# EAGLE design motherboard (EAGLE 5.06)
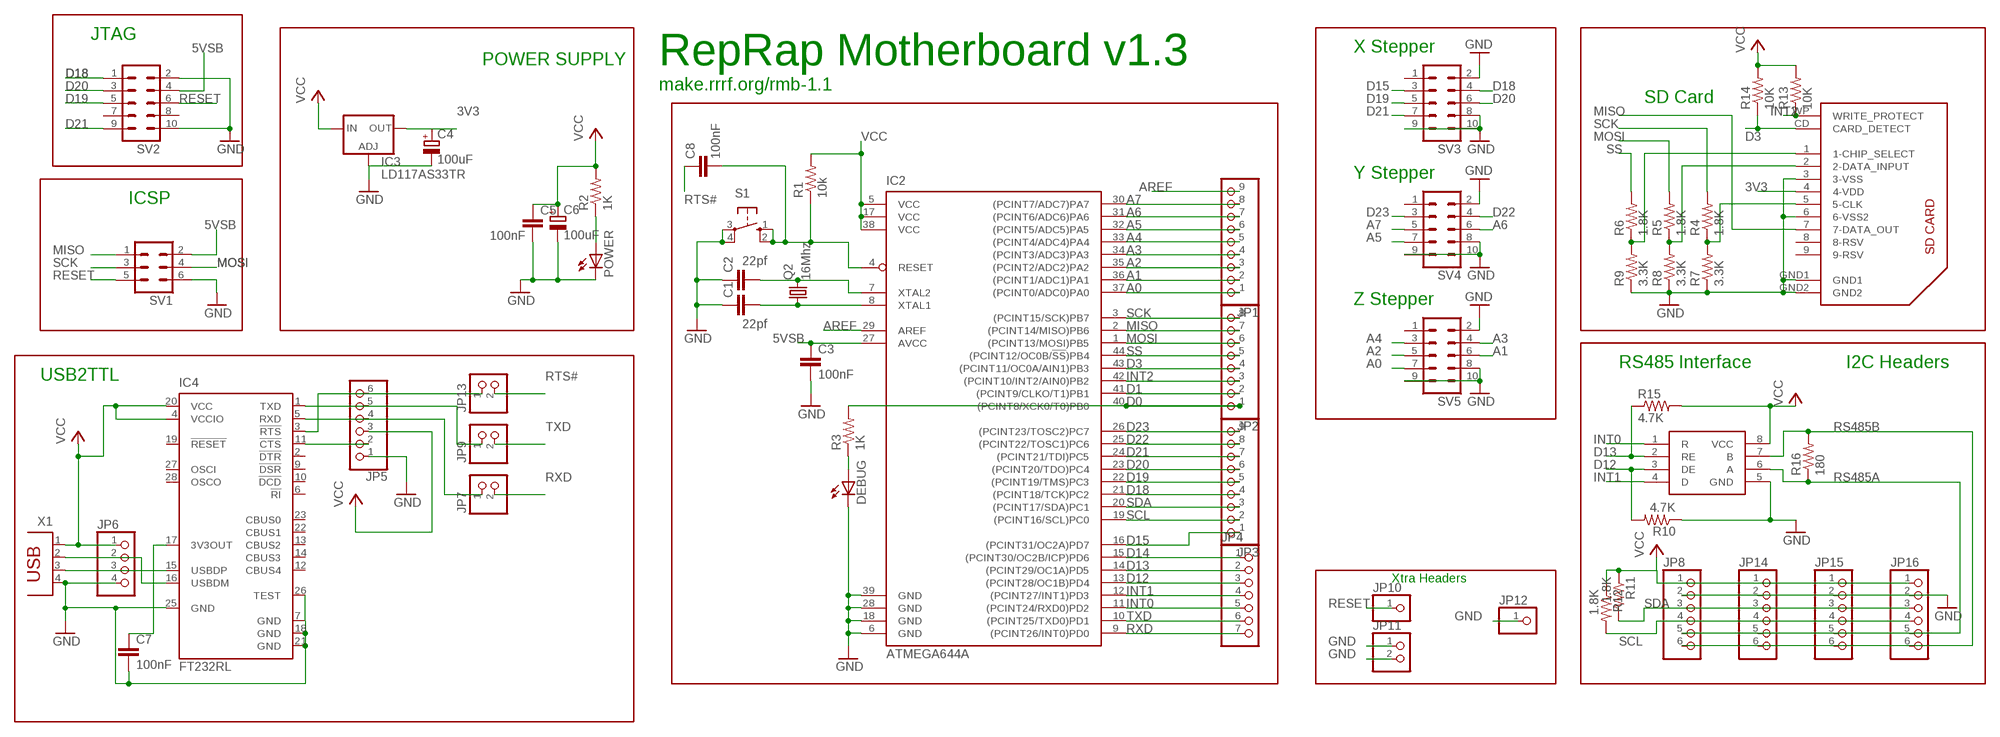
[diagram p0: schematic, sheet 1]

## Parts
C1  22pf  C-EUC1206  [C1206]
C2  22pf  C-EUC1206  [C1206]
C3  100nF  C-EUC1206  [C1206]
C4  100uF  CPOL-EUSANYO_SMD_B6  [SANYO-OSCON_SMD_B6]
C5  100nF  C-EUC1206  [C1206]
C6  100uF  CPOL-EUSANYO_SMD_B6  [SANYO-OSCON_SMD_B6]
C7  100nF  C-EUC1206  [C1206]
C8  100nF  C-EUC1206  [C1206]
DEBUG  LEDCHIPLED_1206  [CHIPLED_1206]
IC1  SN75176ASOIC  [SO08]
IC2  ATMEGA644A  [TQFP44]
IC3  LD117AS33TR  [SOT223]
IC4  FT232RL  [SSOP28]
JP1  PINHD-1X9  [1X09]
JP2  PINHD-1X8  [1X08]
JP3  PINHD-1X9  [1X09]
JP4  PINHD-1X7  [1X07]
JP5  PINHD-1X6  [1X06]
JP6  PINHD-1X4  [1X04]
JP7  PINHD-1X2  [1X02]
JP8  PINHD-1X6  [1X06]
JP9  PINHD-1X2  [1X02]
JP10  PINHD-1X1  [1X01]
JP11  PINHD-1X2  [1X02]
JP12  PINHD-1X1  [1X01]
JP13  PINHD-1X2  [1X02]
JP14  PINHD-1X6  [1X06]
JP15  PINHD-1X6  [1X06]
JP16  PINHD-1X6  [1X06]
POWER  LEDCHIPLED_1206  [CHIPLED_1206]
Q2  16Mhz  CRYSTALHC49UV  [HC49U-V]
R1  10k  R-US_R1206  [R1206]
R2  1K  R-US_R1206  [R1206]
R3  1K  R-US_R1206  [R1206]
R4  1.8K  R-US_R1206  [R1206]
R5  1.8K  R-US_R1206  [R1206]
R6  1.8K  R-US_R1206  [R1206]
R7  3.3K  R-US_R1206  [R1206]
R8  3.3K  R-US_R1206  [R1206]
R9  3.3K  R-US_R1206  [R1206]
R10  4.7K  R-US_R1206  [R1206]
R11  1.8K  R-US_R1206  [R1206]
R12  1.8K  R-US_R1206  [R1206]
R13  10K  R-US_R1206  [R1206]
R14  10K  R-US_R1206  [R1206]
R15  4.7K  R-US_R1206  [R1206]
R16  180  R-US_R1206  [R1206]
S1  10-XX  [B3F-10XX]
SV1  ML6  [ML6]
SV2  ML10  [ML10]
SV3  ML10  [ML10]
SV4  ML10  [ML10]
SV5  ML10  [ML10]
U$8  SDCARD  [3M-SDCARD]
X1  PN61729  [PN61729]

## Nets
3V3: C4.+ IC3.4(OUT) U$8.4(4-VDD)
5VSB: C3.1 IC2.27(AVCC) SV1.2 SV2.4
A0: IC2.37((PCINT0/ADC0)PA0) JP1.1 SV5.7
A1: IC2.36((PCINT1/ADC1)PA1) JP1.2 SV5.6
A2: IC2.35((PCINT2/ADC2)PA2) JP1.3 SV5.5
A3: IC2.34((PCINT3/ADC3)PA3) JP1.4 SV5.4
A4: IC2.33((PCINT4/ADC4)PA4) JP1.5 SV5.3
A5: IC2.32((PCINT5/ADC5)PA5) JP1.6 SV4.7
A6: IC2.31((PCINT6/ADC6)PA6) JP1.7 SV4.6
A7: IC2.30((PCINT7/ADC7)PA7) JP1.8 SV4.5
AREF: IC2.29(AREF) JP1.9
D0: IC2.40((PCINT8/XCK0/T0)PB0) JP2.1 R3.2
D1: IC2.41((PCINT9/CLKO/T1)PB1) JP2.2
D3: IC2.43((PCINT11/OC0A/AIN1)PB3) JP2.4 R14.1 U$8.CD(CARD_DETECT)
D12: IC1.3(DE) IC2.13((PCINT28/OC1B)PD4) JP4.3 R10.2
D13: IC1.2(RE) IC2.14((PCINT29/OC1A)PD5) JP4.2 R15.1
D14: IC2.15((PCINT30/OC2B/ICP)PD6) JP4.1
D15: IC2.16((PCINT31/OC2A)PD7) JP3.1 SV3.3
D18: IC2.21((PCINT18/TCK)PC2) JP3.4 SV2.1 SV3.4
D19: IC2.22((PCINT19/TMS)PC3) JP3.5 SV2.5 SV3.5
D20: IC2.23((PCINT20/TDO)PC4) JP3.6 SV2.3 SV3.6
D21: IC2.24((PCINT21/TDI)PC5) JP3.7 SV2.9 SV3.7
D22: IC2.25((PCINT22/TOSC1)PC6) JP3.8 SV4.4
D23: IC2.26((PCINT23/TOSC2)PC7) JP3.9 SV4.3
GND [power]: C1.1 C2.1 C3.2 C4.- C5.2 C6.- C7.2 DEBUG.C IC1.5(GND) IC2.6(GND) IC2.18(GND) IC2.28(GND) IC2.39(GND) IC3.1(ADJ) IC4.7(GND) IC4.18(GND) IC4.21(GND) IC4.25(GND) IC4.26(TEST) JP5.1 JP6.4 JP8.2 JP11.1 JP11.2 JP12.1 JP14.2 JP15.2 JP16.2 POWER.C R7.1 R8.1 R9.1 R10.1 S1.3(P) S1.4(P1) SV1.6 SV2.2 SV2.10 SV3.2 SV3.8 SV3.9 SV3.10 SV4.2 SV4.8 SV4.9 SV4.10 SV5.2 SV5.8 SV5.9 SV5.10 U$8.3(3-VSS) U$8.6(6-VSS2) U$8.GND1 U$8.GND2 X1.4
INT0: IC1.1(R) IC2.11((PCINT24/RXD0)PD2) JP4.5
INT1: IC1.4(D) IC2.12((PCINT27/INT1)PD3) JP4.4
INT2: IC2.42((PCINT10/INT2/AIN0)PB2) JP2.3 R13.1 U$8.WP(WRITE_PROTECT)
MISO: IC2.2((PCINT14/MISO)PB6) JP2.7 SV1.1 U$8.7(7-DATA_OUT)
MOSI: IC2.1((PCINT13/MOSI)PB5) JP2.6 R5.2 SV1.4
N$1: C2.2 IC2.7(XTAL2) Q2.2
N$2: IC4.11(!CTS) JP5.2
N$3: IC4.15(USBDP) JP6.3 X1.3
N$4: POWER.A R2.1
N$5: IC4.16(USBDM) JP6.2 X1.2
N$6: C7.1 IC4.17(3V3OUT)
N$7: DEBUG.A R3.1
N$8: C1.2 IC2.8(XTAL1) Q2.1
N$14: R6.1 R9.2 U$8.1(1-CHIP_SELECT)
N$17: R5.1 R8.2 U$8.2(2-DATA_INPUT)
N$23: R4.1 R7.2 U$8.5(5-CLK)
RESET: C8.2 IC2.4(RESET) JP10.1 R1.1 S1.1(S) S1.2(S1) SV1.5 SV2.6
RS485A: IC1.6(A) JP8.5 JP14.5 JP15.5 JP16.5 R16.1
RS485B: IC1.7(B) JP8.6 JP14.6 JP15.6 JP16.6 R16.2
RTS#: C8.1 JP13.2
RTS##: IC4.3(!RTS) JP5.6 JP13.1
RXD: IC2.9((PCINT26/INT0)PD0) JP4.7 JP7.2
RXD#: IC4.5(RXD) JP5.4 JP7.1
SCK: IC2.3((PCINT15/SCK)PB7) JP2.8 R4.2 SV1.3
SCL: IC2.19((PCINT16/SCL)PC0) JP3.2 JP8.4 JP14.4 JP15.4 JP16.4 R12.2
SDA: IC2.20((PCINT17/SDA)PC1) JP3.3 JP8.3 JP14.3 JP15.3 JP16.3 R11.2
SS: IC2.44((PCINT12/OC0B/!SS!)PB4) JP2.5 R6.2
TXD: IC2.10((PCINT25/TXD0)PD1) JP4.6 JP9.2
TXD#: IC4.1(TXD) JP5.5 JP9.1
VCC [power]: C5.1 C6.+ IC1.8(VCC) IC2.5(VCC) IC2.17(VCC) IC2.38(VCC) IC3.3(IN) IC4.4(VCCIO) IC4.20(VCC) JP5.3 JP6.1 JP8.1 JP14.1 JP15.1 JP16.1 R1.2 R2.2 R11.1 R12.1 R13.2 R14.2 R15.2 X1.1
Unconnected: IC4.2(!DTR) IC4.6(!RI) IC4.9(!DSR) IC4.10(!DCD) IC4.12(CBUS4) IC4.13(CBUS2) IC4.14(CBUS3) IC4.19(!RESET) IC4.22(CBUS1) IC4.23(CBUS0) IC4.27(OSCI) IC4.28(OSCO) SV2.7 SV2.8 SV3.1 SV4.1 SV5.1 U$8.8(8-RSV) U$8.9(9-RSV)

## Notes on the sheet
- JTAG
- X Stepper
- POWER SUPPLY | RepRap Motherboard v1.3
- make.rrrf.org/rmb-1.1
- SD Card
- Y Stepper
- ICSP
- Z Stepper
- RS485 Interface | I2C Headers
- USB2TTL
- Xtra Headers

## Library data of the parts
C1-C3 C5 C7 C8 = rcl:C-EU: CAPACITOR, European symbol
C4 C6 = rcl:CPOL-EU: POLARIZED CAPACITOR, European symbol
DEBUG POWER = led:LED: LED OSRAM: - CHIPLED LG R971, LG N971, LY N971, LG Q971, LY Q971, LO R971, LY R971 LH N974, LH R974 LS Q976, LO Q976, LY Q976 LO Q996 - Hyper CHIPLED LW Q18S LB Q993, LB Q99A, LB R99A - SideLED LS A670, LO A670, LY A670, LG A670, LP A670 LB A673, LV A673, LT A673, LW A673 LH A674 LY A675 LS A676, LA A676, LO A676, LY A676, LW A676 LS A679, LY A679, LG A679 - Hyper Micro SIDELED® LS Y876, LA Y876, LO Y876, LY Y876 LT Y87S - SmartLED LW L88C, LW L88S LB L89C, LB L89S, LG L890 LS L89K, LO L89K, LY L89K LS L896, LA L896, LO L896, LY L896 - TOPLED LS T670, LO T670, LY T670, LG T670, LP T670 LSG T670, LSP T670, LSY T670, LOP T670, LYG T670 LG T671, LOG T671, LSG T671 LB T673, LV T673, LT T673, LW T673 LH T674 LS T676, LA T676, LO T676, LY T676, LB T676, LH T676, LSB T676, LW T676 LB T67C, LV T67C, LT T67C, LS T67K, LO T67K, LY T67K, LW E67C LS E67B, LA E67B, LO E67B, LY E67B, LB E67C, LV E67C, LT E67C LW T67C LS T679, LY T679, LG T679 LS T770, LO T770, LY T770, LG T770, LP T770 LB T773, LV T773, LT T773, LW T773 LH T774 LS E675, LA E675, LY E675, LS T675 LS T776, LA T776, LO T776, LY T776, LB T776 LHGB T686 LT T68C, LB T68C - Hyper Mini TOPLED® LB M676 - Mini TOPLED Santana® LG M470 LS M47K, LO M47K, LY M47K Source: http://www.osram.convergy.de - LUMILED® LXK2-PW12-R00, LXK2-PW12-S00, LXK2-PW14-U00, LXK2-PW14-V00 LXK2-PM12-R00, LXK2-PM12-S00, LXK2-PM14-U00 LXK2-PE12-Q00, LXK2-PE12-R00, LXK2-PE12-S00, LXK2-PE14-T00, LXK2-PE14-U00 LXK2-PB12-K00, LXK2-PB12-L00, LXK2-PB12-M00, LXK2-PB14-N00, LXK2-PB14-P00, LXK2-PB14-Q00 LXK2-PR12-L00, LXK2-PR12-M00, LXK2-PR14-Q00, LXK2-PR14-R00 LXK2-PD12-Q00, LXK2-PD12-R00, LXK2-PD12-S00 LXK2-PH12-R00, LXK2-PH12-S00 LXK2-PL12-P00, LXK2-PL12-Q00, LXK2-PL12-R00 Source: www.luxeon.com
IC1 = reprap:SN75176A
IC2 = atmel:ATMEGA644: 8-bit Microcontroller with 64K Bytes In-System Programmable Flash Source: http://www.atmel.com/dyn/resources/prod_documents/doc2593.pdf
IC3 = v-reg:LD117A?*: Low drop fixed and adjustable positive voltage regulators 1 A Source: http://www.st.com/stonline/products/literature/ds/7194/ld1117axx.pdf
IC4 = ftdichip:FT232R: Source: http://www.ftdichip.com/Documents/DataSheets/DS_FT232R_v104.pdf
JP1 JP3 = pinhead:PINHD-1X9: PIN HEADER
JP2 = pinhead:PINHD-1X8: PIN HEADER
JP4 = pinhead:PINHD-1X7: PIN HEADER
JP5 JP8 JP14-JP16 = pinhead:PINHD-1X6: PIN HEADER
JP6 = pinhead:PINHD-1X4: PIN HEADER
JP7 JP9 JP11 JP13 = pinhead:PINHD-1X2: PIN HEADER
JP10 JP12 = pinhead:PINHD-1X1: PIN HEADER
Q2 = SparkFun:CRYSTAL: Crystals Various standard crystals. Proven footprints. Spark Fun Electronics SKU : COM-00534
R1 R2 R10-R16 = rcl:R-US_: RESISTOR, American symbol
R3-R9 = resistor:R-US_: RESISTOR, American symbol
S1 = switch-omron:10-XX: OMRON SWITCH
SV1 = con-harting-ml:ML6: HARTING
SV2 SV3 = con-harting-ml:ML10: HARTING
SV4 SV5 = con-ml:ML10: HARTING
U$8 = reprap:SDCARD
X1 = con-berg:PN61729: BERG USB connector

## Net classes
0 default: width 0.406 mm, clearance 0.305 mm
1 power: width 0.635 mm, clearance 0.406 mm

## Board
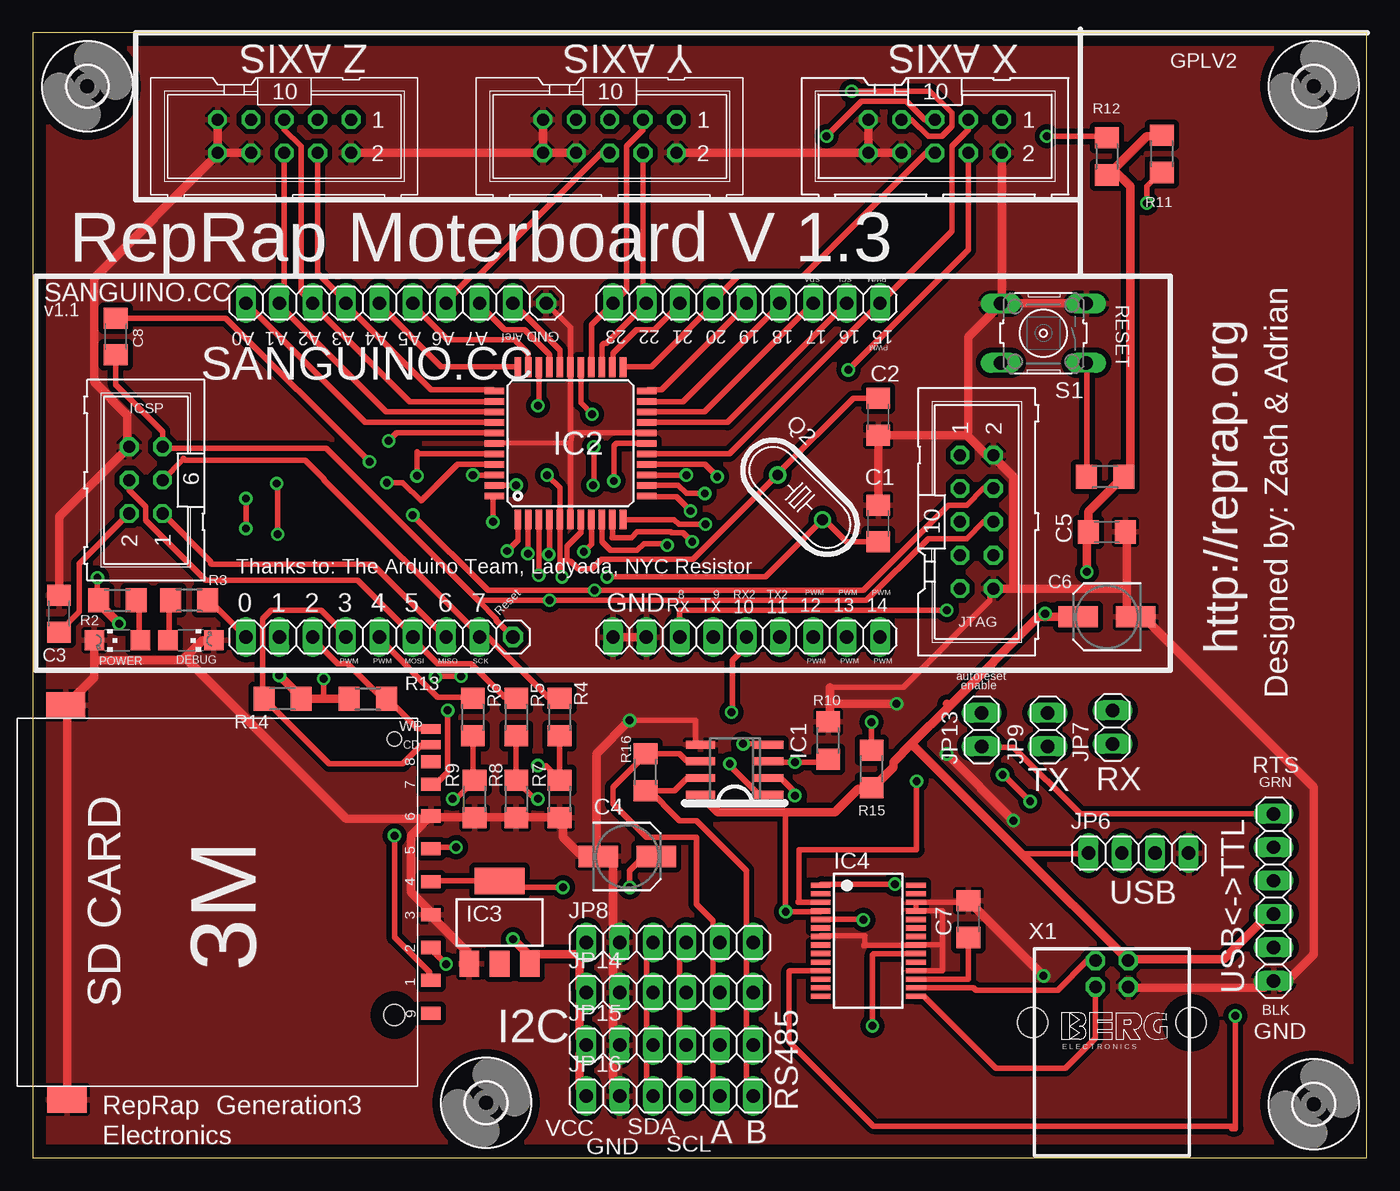
[diagram p1: board, top side]
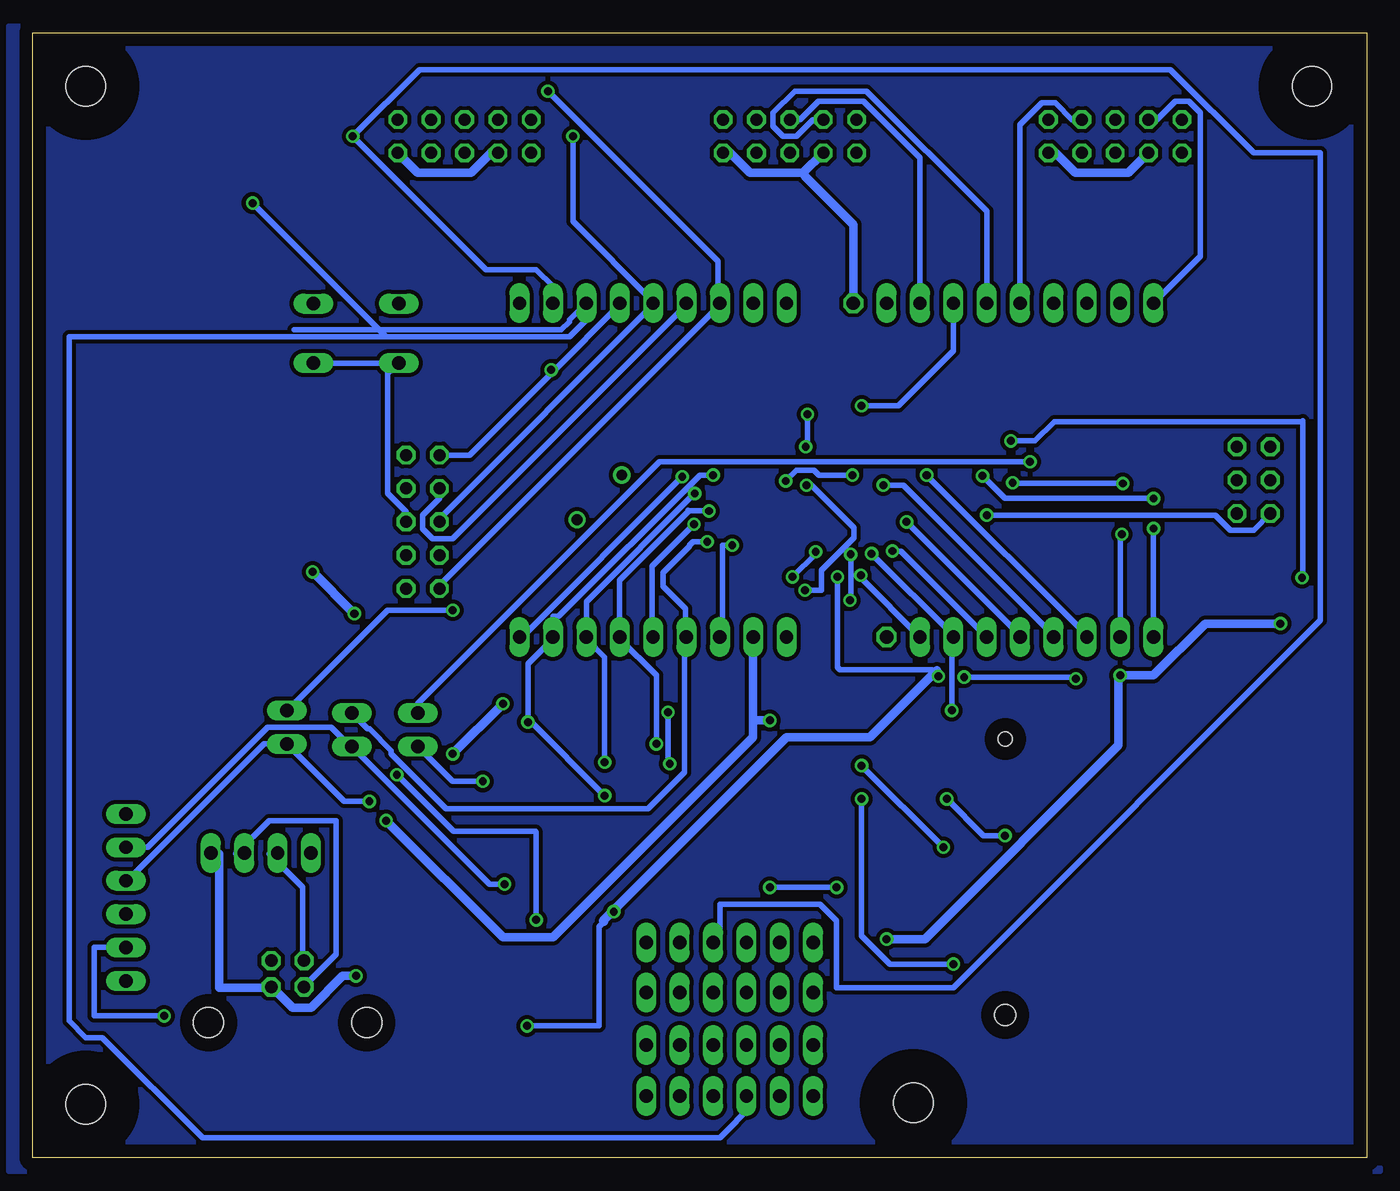
[diagram p2: board, bottom side, seen from below]

Size 101.52 x 85.59 mm. Coordinates in mm from the lower left corner, seen from the top.
Outline: 0,0 101.52,0 101.52,85.59 0,85.59 0,0
Copper layers (1*16): Top 0.035mm / dielectric 1.5mm / Bottom 0.035mm
Design rules "default *": minimum track width 10mil, minimum drill 24mil, track to track 8mil, track to pad 8mil, pad to pad 8mil, via to via 8mil, smd to smd 8mil, copper to edge 40mil, drill to drill 8mil, minimum pad ring 10mil, minimum via ring 8mil, stop-mask expansion 4mil, vias tented up to drill 0mil, thermal gap 10mil

### Footprints (pad centres in the part's own frame; a part is rotated, then mirrored left to right if it is on the bottom)
C1206 = smd 1.6 x 1.8: 1 -1.4,0; 2 1.4,0
SANYO-OSCON_SMD_B6 = smd 3 x 1.6: + 2.2,0; - -2.2,0
CHIPLED_1206 = smd 1.5 x 1.5: A 0,-1.75; C 0,1.75
SO08 = smd 0.6 x 2.2: 1 -1.905,-2.6; 2 -0.635,-2.6; 3 0.635,-2.6; 4 1.905,-2.6; 5 1.905,2.6; 6 0.635,2.6; 7 -0.635,2.6; 8 -1.905,2.6
TQFP44 = smd 1.5 x 0.5: 1 -5.8,4; 2 -5.8,3.2; 3 -5.8,2.4; 4 -5.8,1.6; 5 -5.8,0.8; 6 -5.8,0; 7 -5.8,-0.8; 8 -5.8,-1.6; 9 -5.8,-2.4; 10 -5.8,-3.2; 11 -5.8,-4; 23 5.8,-4; 24 5.8,-3.2; 25 5.8,-2.4; 26 5.8,-1.6; 27 5.8,-0.8; 28 5.8,0; 29 5.8,0.8; 30 5.8,1.6; 31 5.8,2.4; 32 5.8,3.2; 33 5.8,4 | smd 0.5 x 1.5: 12 -4,-5.8; 13 -3.2,-5.8; 14 -2.4,-5.8; 15 -1.6,-5.8; 16 -0.8,-5.8; 17 0,-5.8; 18 0.8,-5.8; 19 1.6,-5.8; 20 2.4,-5.8; 21 3.2,-5.8; 22 4,-5.8; 34 4,5.8; 35 3.2,5.8; 36 2.4,5.8; 37 1.6,5.8; 38 0.8,5.8; 39 0,5.8; 40 -0.8,5.8; 41 -1.6,5.8; 42 -2.4,5.8; 43 -3.2,5.8; 44 -4,5.8
SOT223 = smd 1.5 x 2: 1 -2.3,-3.15; 2 0,-3.15; 3 2.3,-3.15 | smd 3.8 x 2: 4 0,3.15
SSOP28 = smd 0.4 x 1.5: 1 -4.225,-3.625; 2 -3.575,-3.625; 3 -2.925,-3.625; 4 -2.275,-3.625; 5 -1.625,-3.625; 6 -0.975,-3.625; 7 -0.325,-3.625; 8 0.325,-3.625; 9 0.975,-3.625; 10 1.625,-3.625; 11 2.275,-3.625; 12 2.925,-3.625; 13 3.575,-3.625; 14 4.225,-3.625; 15 4.225,3.625; 16 3.575,3.625; 17 2.925,3.625; 18 2.275,3.625; 19 1.625,3.625; 20 0.975,3.625; 21 0.325,3.625; 22 -0.325,3.625; 23 -0.975,3.625; 24 -1.625,3.625; 25 -2.275,3.625; 26 -2.925,3.625; 27 -3.575,3.625; 28 -4.225,3.625
1X09 = drill 1.016 long: 1 -10.16,0; 2 -7.62,0; 3 -5.08,0; 4 -2.54,0; 5 0,0; 6 2.54,0; 7 5.08,0; 8 7.62,0; 9 10.16,0
1X08 = drill 1.016 long: 1 -8.89,0; 2 -6.35,0; 3 -3.81,0; 4 -1.27,0; 5 1.27,0; 6 3.81,0; 7 6.35,0; 8 8.89,0
1X07 = drill 1.016 long: 1 -7.62,0; 2 -5.08,0; 3 -2.54,0; 4 0,0; 5 2.54,0; 6 5.08,0; 7 7.62,0
1X06 = drill 1.016 long: 1 -6.35,0; 2 -3.81,0; 3 -1.27,0; 4 1.27,0; 5 3.81,0; 6 6.35,0
1X04 = drill 1.016 long: 1 -3.81,0; 2 -1.27,0; 3 1.27,0; 4 3.81,0
1X02 = drill 1.016 long: 1 -1.27,0; 2 1.27,0
1X01 = drill 1.016 octagon: 1 0,0
HC49U-V = drill 0.813 round: 1 -2.413,0; 2 2.413,0
R1206 = smd 1.6 x 1.803: 1 -1.422,0; 2 1.422,0
B3F-10XX = drill 1.016 long: 1 -3.251,2.261; 2 3.251,2.261; 3 -3.251,-2.261; 4 3.251,-2.261
ML6 = drill 0.914 octagon: 1 -2.54,-1.27; 2 -2.54,1.27; 3 0,-1.27; 4 0,1.27; 5 2.54,-1.27; 6 2.54,1.27
ML10 = drill 0.914 octagon: 1 -5.08,-1.27; 2 -5.08,1.27; 3 -2.54,-1.27; 4 -2.54,1.27; 5 0,-1.27; 6 0,1.27; 7 2.54,-1.27; 8 2.54,1.27; 9 5.08,-1.27; 10 5.08,1.27
3,0 = hole 3: 0,0
3M-SDCARD = smd 1 x 1.5: 1 5.93,16.5; 2 3.43,16.5; 3 0.93,16.5; 4 -1.57,16.5; 5 -4.07,16.5; 6 -6.57,16.5; 7 -9,16.5; 8 -10.7,16.5; 9 8.43,16.5 | smd 0.7 x 1.5: CD -12,16.5; WP -13.2,16.5 | smd 2 x 3: GND1 -15,-11.3; GND2 15,-11.2 | hole 1.1: -12.427,13.705 | hole 1.6: 8.567,13.708
PN61729 = drill 0.95 octagon: 1 1.25,4.71; 2 -1.25,4.71; 3 -1.25,2.71; 4 1.25,2.71 | hole 2.3: -6.02,0; 6.02,0

### Placement (x,y rotation side)
C1  64.35,48.26 270 top
C2  64.35,56.38 90 top
C3  1.99,41.4 90 top
C4  45.24,22.92 0 top
C5  81.75,47.62 0 top
C6  81.75,41.14 180 top
C7  71.21,18.16 90 top
C8  6.31,62.48 270 top
DEBUG  12.03,39.37 270 top
IC1  53.43,29.52 90 top
IC2  40.92,54.35 90 top
IC3  35.52,17.9 0 top
IC4  63.59,16.5 270 top
JP1  26.38,65.02 0 top
JP2  25.11,39.62 0 top
JP3  54.32,65.02 180 top
JP4  56.86,39.62 180 top
JP5  94.45,19.81 90 top
JP6  84.16,23.17 0 top
JP7  82.19,32.76 90 top
JP8  48.48,16.38 0 top
JP9  77.24,32.57 90 top
JP10  36.54,39.62 0 top
JP11  45.43,39.62 180 top
JP12  39.08,65.02 0 top
JP13  72.23,32.57 90 top
JP14  48.48,12.57 0 top
JP15  48.48,8.57 0 top
JP16  48.48,4.69 0 top
POWER  6.44,39.37 90 top
Q2  58.4,50.25 135 top
R1  81.62,51.81 0 top
R2  6.44,42.41 180 top
R3  11.9,42.41 0 top
R4  40.09,33.52 90 top
R5  36.79,33.52 90 top
R6  33.49,33.52 90 top
R7  40.09,27.3 90 top
R8  36.79,27.3 90 top
R9  33.62,27.3 90 top
R10  60.54,31.74 270 top
R11  85.94,76.39 270 top
R12  81.75,76.19 90 top
R13  25.49,34.92 180 top
R14  19.01,34.92 0 top
R15  63.84,29.59 270 top
R16  46.63,29.33 270 top
S1  76.92,62.73 180 top
SV1  8.6,51.56 90 top
SV2  71.84,48.38 270 top
SV3  68.67,77.72 180 top
SV4  43.9,77.72 180 top
SV5  19.14,77.72 180 top
U$1  [3,0]  34.51,4.19 0 top
U$3  [3,0]  4.15,81.53 0 top
U$4  [3,0]  97.5,81.53 0 top
U$5  [3,0]  97.5,4.06 0 top
U$8  13.81,19.43 270 top
X1  82.13,10.28 0 top

### Tracks (layer width: path | path; a pad name or v marks a point on that pad's centre or on a via)
3V3  (via drill 0.61)
  Top 0.406: U$8.4 30.31,21.08 35.52,21.08 IC3.4 36.54,20.57 v40.35,20.57 | v45.43,20.57 45.43,21.84 46.7,23.11 C4.+
  Bottom 0.406: v40.35,20.57 v45.43,20.57
5VSB  (via drill 0.6, 0.61)
  Top 0.406: SV1.2 3.52,45.21 3.52,41.52 C3.1 | SV2.4 72.35,50.92 71.08,49.65 69.69,49.65 63.21,43.18 v42.76,43.18 34.63,43.18 v28.92,48.89 | IC2.27 41.72,57.42 v42.57,56.57 | v42.7,54.1 42.7,51.24 v42.63,51.18
  Bottom 0.406: v28.92,48.89 11.52,48.89 10.38,47.75 8.6,47.75 SV1.2 | v42.57,56.57 42.57,54.22 v42.7,54.1 | 42.63,43.37 42.82,43.18 v42.76,43.18 41.49,43.18 41.49,44.7 39.02,47.18 39.02,47.94 42.25,51.18 v42.63,51.18
A0
  Top 0.406: IC2.37 25.29,55.95 JP1.1
  Bottom 0.406: SV5.7 15.96,78.99 14.57,80.39 13.55,80.39 12.66,79.5 12.66,68.57 JP1.1
A1
  Top 0.406: IC2.36 35.01,56.76 26.89,56.76 18.76,64.89 JP1.2 19.14,64.77 SV5.6
A2
  Top 0.406: IC2.35 35.01,57.53 28.66,57.53 21.3,64.89 JP1.3 20.41,65.91 20.41,76.96 19.14,78.23 SV5.5
A3
  Top 0.406: IC2.34 35.01,58.41 30.31,58.41 23.84,64.89 JP1.4 23.84,65.15 21.68,67.3 SV5.4
A4
  Top 0.406: JP1.5 26.38,64.89 31.08,60.19 36.92,60.19 IC2.33
  Bottom 0.406: SV5.3 22.44,78.99 23.71,80.26 24.73,80.26 26.38,78.61 JP1.5
A5
  Top 0.406: JP1.6 28.92,64.89 31.58,62.23 36.66,62.23 37.68,61.21 37.68,60.19 IC2.32
  Bottom 0.406: SV4.7 42.13,78.99 43.4,77.72 44.41,77.72 45.17,78.48 45.17,79.5 43.52,81.15 38.06,81.15 28.92,72 JP1.6
A6  (via drill 0.6)
  Top 0.406: SV4.6 43.27,76.45 33.87,67.05 33.36,67.05 31.46,65.15 JP1.7 | IC2.31 38.52,57.29 v38.44,57.21
  Bottom 0.406: v38.44,57.21 35.65,57.21 31.46,61.4 JP1.7
A7
  Top 0.406: JP1.8 34,64.89 35.9,62.99 37.43,62.99 39.33,61.08 39.33,60.19 IC2.30
  Bottom 0.406: SV4.5 43.14,78.99 41.75,80.39 38.32,80.39 34,76.07 JP1.8
AREF
  Top 0.406: IC2.29 40.12,61.44 JP1.9
D0  (via drill 0.6)
  Top 0.406: JP2.1 13.42,42.41 R3.2 | v16.22,47.87 v16.22,50.16 | IC2.40 29.4,53.55 arc-90 29.23,53.72 v29.23,51.88
  Bottom 0.406: JP2.1 v16.22,47.87 | v16.22,50.16 27.52,50.16 v29.23,51.88
D1  (via drill 0.6)
  Top 0.406: v18.63,47.43 18.63,51.24 v18.57,51.3 | v26.95,51.37 28.16,51.37 29.55,49.97 32.35,52.76 35.11,52.76 IC2.41
  Bottom 0.406: JP2.2 18.76,47.3 v18.63,47.43 | v18.57,51.3 26.89,51.3 v26.95,51.37
D3  (via drill 0.61)
  Top 0.406: U$8.CD 30.19,31.36 29.55,31.36 28.16,29.97 22.57,29.97 17.61,34.92 R14.1 17.49,35.05 17.49,41.02 18.12,41.65 21.93,41.65 23.84,39.75 JP2.4 | v36.79,51.18 35.14,51.18 IC2.43
  Bottom 0.406: v36.79,51.18 35.27,51.18 23.84,39.75 JP2.4
D12  (via drill 0.6, 0.61)
  Top 0.406: IC1.3 56.1,30.09 v58,30.09 60.54,30.09 R10.2 | IC2.13 46.83,51.18 49.11,51.18 49.75,50.54 v51.14,50.54
  Bottom 0.406: v58,30.09 58,38.09 59.4,39.49 JP4.3 59.4,42.29 v51.14,50.54
D13  (via drill 0.61)
  Top 0.406: v49.75,51.94 46.83,51.94 IC2.14 | v63.84,33.14 R15.1 | v58,27.55 58,27.81 56.98,28.82 56.1,28.82 IC1.2
  Bottom 0.406: v58,27.55 63.72,33.27 v63.84,33.14 63.84,37.59 61.94,39.49 JP4.2 61.94,41.21 61.49,41.21 50.76,51.94 v49.75,51.94
D14  (via drill 0.6)
  Top 0.406: IC2.15 51.16,52.75 v52.09,51.81
  Bottom 0.406: 52.29,51.81 v52.09,51.81 64.29,39.62 JP4.1
D15
  Top 0.406: SV3.3 71.21,78.23 69.94,76.96 69.94,70.48 JP3.1 53.01,53.55 IC2.16
D18  (via drill 0.61)
  Top 0.406: JP3.4 56.86,64.89 49.49,57.53 46.83,57.53 IC2.21 | SV3.4 71.21,69.08 v62.07,59.94
  Bottom 0.406: SV2.1 68.29,53.46 61.94,59.81 | 61.94,59.81 56.86,64.89 JP3.4 | 61.94,59.81 v62.07,59.94
D19  (via drill 0.61)
  Top 0.406: JP3.5 54.32,64.89 47.84,58.41 46.83,58.41 IC2.22 | SV3.5 67.91,78.99 66.51,80.39 63.08,80.39 v60.41,77.72
  Bottom 0.406: SV2.5 70.57,48.64 54.32,64.89 JP3.5 54.32,65.15 60.41,71.24 v60.41,77.72
D20
  Top 0.406: IC2.23 44.92,60.19 47.08,60.19 51.78,64.89 JP3.6 51.78,65.15 53.68,67.05 58.64,67.05 68.03,76.45 SV3.6
  Bottom 0.406: SV2.3 70.57,50.16 71.84,48.89 71.84,47.87 71.08,47.11 69.56,47.11 51.78,64.89 JP3.6
D21  (via drill 0.61)
  Top 0.406: JP3.7 49.24,64.89 47.33,62.99 45.94,62.99 44.16,61.21 44.16,60.19 IC2.24 | SV3.7 66.89,78.99 68.16,77.72 69.18,77.72 69.94,78.48 69.94,79.5 68.29,81.15 v62.32,81.15
  Bottom 0.406: SV2.9 70.57,43.56 49.24,64.89 JP3.7 49.37,65.15 49.37,68.19 v62.32,81.15
D22
  Top 0.406: SV4.4 46.44,65.27 JP3.8 43.65,61.97 43.46,61.97 43.32,61.83 IC2.25
D23
  Top 0.406: IC2.26 42.51,60.19 42.51,63.37 JP3.9 45.17,66.03 45.17,76.96 46.44,78.23 SV4.3
GND  (via drill 0.61)
  Top 0.406: C7.2 71.21,19.43 IC4.26 IC4.25 69.24,18.78 69.24,16.19 | 69.24,16.19 IC4.21 63.27,16.18 63.27,16.12 63.34,16.12 63.34,16.89 59.96,16.89 IC4.7 | IC4.18 69.24,14.23 69.24,16.19 | JP12.1 40.92,63.18 IC2.28 40.92,55.3 41.05,55.18 | 41.05,55.18 46.69,55.18 IC2.18 | 40.92,54.41 IC2.39 | 41.05,55.18 40.92,54.41 | 40.92,54.41 IC2.6 | 72.86,43.18 72.86,42.41 66.26,35.81 60.67,35.81 60.54,35.81 | IC1.5 50.45,31.43 50.45,33.27 v45.43,33.27
  Top 0.635: 4.66,37.84 4.66,36.57 2.63,34.54 U$8.GND1 2.63,34.16 2.63,4.44 U$8.GND2 | 4.66,37.84 4.66,39.37 POWER.C | 11.58,38.03 11.39,37.84 4.66,37.84 | 11.58,38.03 12.92,39.37 DEBUG.C | JP11.1 JP11.2 | U$8.6 30.31,25.9 33.62,25.9 R9.1 33.87,25.9 36.79,25.9 R8.1 37.05,25.9 40.09,25.9 R7.1 40.35,25.65 40.35,24.38 41.62,23.11 C4.- | 32.86,14.73 IC3.1 33.11,14.85 33.11,15.62 30.31,18.41 U$8.3 30.19,18.79 28.79,20.19 28.79,24.51 30.06,25.78 U$8.6 | 11.58,38.03 23.84,25.78 29.68,25.78 U$8.6 | C3.2 1.99,48.76 SV1.6 7.2,54.35 7.2,56.51 4.66,59.05 4.66,66.92 13.93,76.19 SV5.10 | SV5.10 SV5.9 | SV5.8 SV5.10 | SV4.10 SV4.9 | SV4.8 SV4.10 | SV4.10 SV5.2 | v76.92,13.84 C7.2 | 83.27,43.3 83.27,41.78 83.91,41.14 C6.- 84.8,40.89 97.5,28.19 97.5,15.49 94.96,12.95 JP5.1 93.69,12.95 83.53,12.95 X1.4 | 83.27,43.3 83.27,47.62 C5.2 | 74.64,43.3 SV2.10 72.86,43.18 | 74.64,43.3 83.27,43.3 | C1.1 C2.1 64.61,54.99 71.08,54.99 | 71.08,54.99 72.61,53.46 SV2.2 73.24,53.21 74.64,51.81 74.64,43.3 | SV3.10 SV3.9 | SV3.8 SV3.10 | SV3.2 73.75,65.02 S1.4 | S1.3 80.1,65.02 74,65.02 S1.4 | 71.08,54.99 71.21,55.24 71.21,62.48 73.5,64.77 S1.4 | SV3.10 SV4.2 | JP16.2 44.16,5.33 44.16,7.87 JP15.2 44.16,9.14 44.16,11.68 JP14.2 44.16,12.95 44.16,15.49 JP8.2 44.16,16.76 44.16,23.11 C4.- | 60.67,34.54 60.67,35.81 | 60.67,34.54 60.67,33.27 R10.1 | v65.75,34.54 60.67,34.54 | v74.64,25.65 v69.56,30.73 | v45.43,33.27 42.89,30.73 42.89,23.11 C4.-
  Bottom 0.635: SV5.2 23.71,76.45 22.19,74.92 18.12,74.92 SV5.8 | SV4.2 48.48,76.45 46.95,74.92 42.89,74.92 | 42.89,74.92 SV4.8 | JP12.1 39.08,70.99 42.76,74.67 42.89,74.92 | v76.92,13.84 77.94,13.84 80.35,11.43 81.75,11.43 83.27,12.95 X1.4 83.53,12.95 87.34,12.95 87.34,23.11 JP6.4 | SV3.8 66.64,76.45 68.16,74.92 72.23,74.92 SV3.2 | 81.24,65.02 80.23,65.02 S1.3 | v69.56,30.73 v65.75,34.54 | v74.64,25.65 65.75,16.76 61.94,16.76 46.7,32 46.7,33.27 | 46.7,33.27 JP11.1 | v45.43,33.27 46.7,33.27
  pour Top: -0.55,86.1 103.09,86.1 103.09,85.85 103.09,-1.02 -0.8,-1.02 -0.8,86.1
INT0  (via drill 0.6)
  Top 0.406: JP4.5 54.32,38.92 53.24,37.84 53.24,33.97 v53.18,33.9 | v53.05,29.97 53.05,29.84 55.53,27.36 55.78,27.36 IC1.1 | IC2.11 48.82,48.55 49.17,48.19 v51.21,48.19
  Bottom 0.406: v53.18,33.9 53.18,30.09 v53.05,29.97 | v51.21,48.19 54.38,45.02 54.38,39.68 JP4.5
INT1  (via drill 0.6, 0.61)
  Top 0.406: IC2.12 46.83,50.29 48.98,50.29 v50.06,49.21 | v54.06,31.49 55.97,31.49 IC1.4
  Bottom 0.406: v54.06,31.49 54.06,36.7 56.86,39.49 JP4.4 56.86,43.94 51.65,49.14 51.65,49.27 51.59,49.21 v50.06,49.21
INT2  (via drill 0.61)
  Top 0.406: U$8.WP 30.19,32.63 29.3,32.63 27.01,34.92 R13.1 26.76,35.05 26.5,35.05 23.96,37.59 23.2,37.59 21.3,39.49 JP2.3 | v33.49,51.94 35.01,51.94 IC2.42
  Bottom 0.406: v33.49,51.94 21.3,39.75 JP2.3
MISO  (via drill 0.61)
  Top 0.406: v31.58,34.03 31.58,29.33 30.7,28.44 30.31,28.44 U$8.7 | v37.68,45.97 37.68,48.51 IC2.2 | JP2.7 31.46,39.75 31.27,39.75 25.87,45.14 13.62,45.14 13.55,45.21 13.55,45.33 SV1.1
  Bottom 0.406: v31.58,34.03 31.58,39.49 JP2.7 31.46,39.75 v37.68,45.97
MOSI  (via drill 0.6)
  Top 0.406: R5.2 36.79,35.05 35.9,35.05 33.36,37.59 30.82,37.59 28.92,39.49 JP2.6 28.92,39.75 24.73,43.94 13.17,43.94 8.6,48.51 8.6,49.53 7.33,50.8 SV1.4 | IC2.1 36.92,46.98 v36.09,46.16
  Bottom 0.406: v36.09,46.16 35.46,46.16 JP2.6
N$1
  Top 0.406: C2.2 62.45,57.78 56.73,52.07 Q2.2 50.26,45.53 43.27,45.53 42.57,44.83 41.49,44.83 40.92,45.4 40.73,45.4 40.66,45.46 40.66,46.54 41.72,47.59 IC2.7
N$2  (via drill 0.6)
  Top 0.406: IC4.11 57.63,14.23 57.56,14.16 57.56,8.82 63.97,2.41 91.28,2.41 91.28,2.22 91.53,2.22 v91.53,10.79
  Bottom 0.406: v91.53,10.79 96.86,10.79 96.86,16 JP5.2
N$3
  Top 0.406: IC4.15 67.81,12.28 73.31,6.79 78.58,6.79 80.86,9.08 80.86,12.97 X1.3
  Bottom 0.406: X1.3 80.99,12.95 78.45,15.49 78.45,25.65 83.53,25.65 86.07,23.11 JP6.3
N$4
  Top 0.406: POWER.A 8.09,39.37 8.09,42.29 7.96,42.41 R2.1
N$5
  Top 0.406: X1.2 80.24,14.99 78,12.76 71.78,12.76 71.61,12.93 IC4.16
  Bottom 0.406: X1.2 80.99,15.49 80.99,20.57 83.53,23.11 JP6.2
N$6
  Top 0.406: IC4.17 71.21,13.58 C7.1
N$7
  Top 0.406: DEBUG.A 10.38,39.37 10.38,42.41 R3.1
N$8  (via drill 0.6)
  Top 0.406: IC2.8 42.51,48.51 | Q2.1 60.03,48.51 | C1.2 61.94,46.86 60.29,48.51 Q2.1 | IC2.8 42.51,48.38 | IC2.8 42.52,46.68 v41.94,46.1 | v43.71,44.19 55.75,44.19 Q2.1
  Bottom 0.406: v41.94,46.1 41.94,45.97 v43.71,44.19
N$9
  pour Bottom: -0.8,86.1 103.34,86.1 103.34,85.85 103.34,-1.02 -1.05,-1.02 -1.05,-0.77 -0.8,-0.77
N$10
  pour Bottom: -0.8,86.1 -0.55,86.1 -0.55,85.85
N$14  (via drill 0.61)
  Top 0.406: v27.52,24.51 27.52,16.76 30.19,14.09 30.19,13.58 U$8.1 | v31.97,27.3 32.22,27.3 33.62,28.7 R9.2 33.49,28.82 R6.1
  Bottom 0.406: v27.52,24.51 29.17,24.51 v31.97,27.3
N$17  (via drill 0.61)
  Top 0.406: v31.46,14.73 30.31,15.87 U$8.2 | v38.44,27.3 38.19,27.3 36.79,28.7 R8.2 R5.1
  Bottom 0.406: v31.46,14.73 36.28,14.73 38.44,16.89 v38.44,27.3
N$23  (via drill 0.61)
  Top 0.406: v32.22,23.62 30.31,23.62 U$8.5 | v38.44,29.84 39.08,29.84 40.09,28.82 R7.2 R4.1
  Bottom 0.406: v32.22,23.62 v38.44,29.84
RESET  (via drill 0.6)
  Top 0.406: R1.1 80.23,51.81 80.23,60.45 S1.1 | C8.2 6.31,58.8 9.87,55.24 SV1.5 10,53.97 22.31,53.97 34,42.29 | JP10.1 35.27,40.89 35.27,41.02 34,42.29 | SV2.6 72.35,48.38 71.08,47.11 68.16,47.11 63.46,42.41 v39.33,42.41 34.12,42.41 34,42.29 | IC2.4 39.32,45.96 v39.27,45.91
  Bottom 0.406: SV2.6 73.11,49.14 74.51,50.54 74.51,59.69 73.75,60.45 S1.2 74,60.45 80.1,60.45 S1.1 | v39.27,45.91 39.27,42.48 v39.33,42.41
RS485A
  Top 0.406: 46.7,30.73 49.24,30.73 49.75,30.22 50.76,30.22 IC1.6 | 46.57,30.6 R16.1 46.7,30.73 | JP16.5 51.78,5.33 51.78,7.87 JP15.5 51.78,9.14 51.78,11.68 JP14.5 51.78,12.95 51.78,15.49 JP8.5 51.78,16.76 51.78,18.03 50.51,19.3 50.51,24.38 46.7,24.38 44.16,26.92 44.16,28.19 46.7,30.73
RS485B
  Top 0.406: IC1.7 50.76,28.82 49.75,28.82 48.86,27.93 46.7,27.93 R16.2 46.7,28.19 49.24,25.65 50.51,25.65 54.32,21.84 54.32,16.76 JP8.6 54.32,15.49 54.32,12.95 JP14.6 54.32,11.68 54.32,9.14 JP15.6 54.32,7.87 54.32,5.33 JP16.6
RTS#  (via drill 0.61)
  Top 0.406: v25.62,52.95 14.69,63.88 C8.1
  Bottom 0.406: v25.62,52.95 53.81,52.95 72.23,34.54 JP13.2
RTS##  (via drill 0.6)
  Top 0.406: JP5.6 79.72,26.16 74.64,31.24 72.23,31.24 JP13.1 | IC4.3 58.26,19.43 58.26,19.49 58.32,19.49 58.32,23.43 67.27,23.43 v67.27,28.63
  Bottom 0.406: v67.27,28.63 69.56,28.63 JP13.1
RXD  (via drill 0.6, 0.61)
  Top 0.406: v69.56,41.65 49.24,41.65 JP4.7 | IC2.9 43.32,46.87 43.97,46.22 46,46.22 46.51,46.73 48.22,46.73 48.29,46.67 v48.29,46.6
  Bottom 0.406: v69.56,41.65 74.51,41.65 82.13,34.03 JP7.2 | v48.29,46.6 49.05,46.6 49.05,39.81 JP4.7
RXD#  (via drill 0.6)
  Top 0.406: IC4.5 63.17,18.13 v63.21,18.09 | v73.81,29.14 73.88,29.14 v75.91,27.11
  Bottom 0.406: JP5.4 94.32,21.08 83.91,31.49 JP7.1 77.81,27.11 v75.91,27.11 | v63.21,18.09 63.21,24.76 63.27,24.82 69.49,24.82 v73.81,29.14
SCK  (via drill 0.6)
  Top 0.406: R4.2 40.09,35.05 39.21,35.05 34.63,39.62 JP2.8 34,39.75 22.19,51.56 22.19,51.62 20.73,53.08 11.58,53.08 11.46,53.21 11.46,53.14 SV1.3 | IC2.3 38.52,44.33 v38.51,44.32
  Bottom 0.406: v38.51,44.32 38.51,44.13 JP2.8
SCL  (via drill 0.61)
  Top 0.406: IC2.19 52.87,55.95 JP3.2 | JP8.4 49.24,15.49 49.24,12.95 JP14.4 49.24,11.68 49.24,9.14 JP15.4 49.24,7.87 49.24,5.33 JP16.4 | v77.18,77.72 80.99,77.72 R12.2
  Bottom 0.406: JP3.2 61.94,66.29 63.21,67.56 67.02,67.56 v77.18,77.72 72.1,82.8 14.95,82.8 8.6,76.45 3.52,76.45 3.52,40.89 31.46,12.95 40.35,12.95 40.35,18.03 41.62,19.3 49.24,19.3 49.24,16.76 JP8.4
SDA  (via drill 0.61)
  Top 0.406: v84.8,72.64 84.8,73.91 86.07,75.18 R11.2 | JP8.3 46.7,15.49 46.7,12.95 JP14.3 46.7,11.68 46.7,9.14 JP15.3 46.7,7.87 46.7,5.33 JP16.3 | IC2.20 51.13,56.75 JP3.3
  Bottom 0.406: 81.62,62.99 61.3,62.99 60.67,63.62 60.67,63.75 JP3.3 59.4,63.75 60.67,62.48 74.64,62.48 | 74.64,62.48 v84.8,72.64 | 74.64,62.48 98.77,62.48 98.77,10.41 97.5,9.14 96.23,9.14 88.61,1.52 49.24,1.52 46.7,4.06 JP16.3
SS  (via drill 0.61)
  Top 0.406: v35.01,48.38 35.01,50.29 IC2.44 | JP2.5 26.38,39.49 30.82,35.05 33.49,35.05 R6.2
  Bottom 0.406: v35.01,48.38 26.38,39.75 JP2.5
TXD  (via drill 0.6)
  Top 0.406: IC2.10 44.12,47.2 44.09,47.18 45.55,47.18 46,47.62 48.54,47.62 48.6,47.56 49.49,47.56 v50.19,46.86
  Bottom 0.406: JP9.2 76.03,32.63 75.91,32.63 74.26,30.98 74.26,30.73 70.07,26.54 54.7,26.54 51.91,29.33 51.91,39.49 JP4.6 51.84,39.68 51.84,41.78 53.56,43.49 53.56,44.51 51.52,46.54 51.52,46.6 51.27,46.86 v50.19,46.86
TXD#  (via drill 0.61)
  Top 0.406: v65.62,20.82 60.03,20.82 IC4.1
  Bottom 0.406: v65.62,20.82 66.76,20.82 JP9.1 77.43,31.36 78.83,32.76 83.66,32.76 92.8,23.62 JP5.5
VCC  (via drill 0.6, 0.61)
  Top 0.406: 61.05,26.28 57.3,26.28 v57.3,18.73 59.96,18.73 IC4.4 | IC4.20 63.97,15.53 63.97,15.43 63.91,15.43 v63.91,10.03 | IC2.38 27.69,55.15 v27.08,54.54 | v4.92,44.13 4.92,42.52 R2.2 | v40.28,44.19 40.12,44.36 IC2.5 40.12,50.96 v39.14,51.94 | v32.6,36.64 30.7,36.64 v30.63,36.57 | v22.12,36.44 22.12,35.17 21.87,34.92 | v44.22,51.49 44.22,54.16 44.41,54.35 IC2.17 | 79.72,23.11 75.24,23.11 75.24,23.14
  Top 0.635: JP5.3 94.07,18.54 90.64,15.11 83.4,15.11 X1.1 83.15,15.24 75.24,23.14 66.89,31.49 | R13.2 21.87,34.92 R14.2 20.28,35.17 v18.76,36.7 | v6.57,40.64 5.04,42.16 5.04,42.41 R2.2 | IC3.3 37.94,14.85 | 50.64,27.55 IC1.8 50.89,27.55 52.16,26.28 61.05,26.28 62.83,28.06 63.84,28.06 R15.2 64.1,28.32 65.49,29.71 65.49,30.09 66.89,31.49 | 77.05,41.14 76.54,41.14 69.75,34.35 | 66.89,31.49 69.75,34.35 | 77.05,41.14 C6.+ | v36.54,16.63 37.94,15.24 IC3.3 | v80.23,44.57 80.23,47.37 C5.1 80.35,49.14 83.02,51.81 R1.2 83.53,52.32 83.53,73.91 82.26,75.18 | 77.05,41.14 v77.05,41.4 | 82.26,75.18 84.8,77.72 86.07,77.72 R11.1 | 82.26,75.18 R12.1 | 41.62,15.49 41.62,12.95 JP14.1 41.62,11.68 41.62,9.14 JP15.1 41.62,7.87 41.62,5.33 JP16.1 | 41.62,15.49 37.81,15.49 IC3.3 | 41.62,15.49 JP8.1 | 79.72,23.11 JP6.1 | 69.75,34.35 69.56,34.54
  Bottom 0.406: 57.3,18.79 v57.3,18.73 58.07,17.96 58.45,17.58 58.45,10.03 v63.91,10.03 | v27.08,54.54 25.23,54.54 23.77,56 4.92,56 4.85,56.07 4.85,44.19 v4.92,44.13 | v40.28,44.19 40.28,37.33 40.09,37.14 33.11,37.14 v32.6,36.64 | v30.63,36.57 22.25,36.57 v22.12,36.44 | v39.14,51.94 41.68,51.94 42.06,52.32 43.4,52.32 v44.22,51.49
  Bottom 0.635: v6.57,40.64 12.28,40.64 16.22,36.7 v18.76,36.7 18.88,36.44 18.88,31.36 33.62,16.63 v36.54,16.63 | v77.05,41.4 v80.23,44.57 | v32.6,36.64 32.73,37.08 37.81,32 44.16,32 58.13,18.03 58.07,17.96

### Text on the board
tPlace: Z AXIS | Y AXIS | X AXIS | GPLV2 | RepRap Moterboard V 1.3 | SDA | SCL | PWM | SANGUINO.CC | RESET | v1.1 | A0 | A1 | A2 | A3 | A4 | A5 | A6 | A7 | GND | 23 | 22 | 21 | 20 | 19 | 18 | 17 | 16 | 15 | Aref | PWM | SANGUINO.CC | ICSP | Thanks to: The Arduino Team, Ladyada, NYC Resistor | PWM | PWM | PWM | 8 | 9 | RX2 | TX2 | 0 | 1 | 2 | 3 | 4 | 5 | 6 | 7 | Reset | GND | Rx | Tx | 10 | 11 | 12 | 13 | 14 | JTAG | http://reprap.org | C3 | PWM | PWM | MOSI | MISO | SCK | PWM | PWM | PWM | autoreset | enable | Designed by: Zach & Adrian | RTS | TX | RX | GRN | USB | USB<->TTL | I2C | BLK | GND | RepRap | Generation3 | VCC | SDA | RS485 | Electronics | GND | A | SCL | B